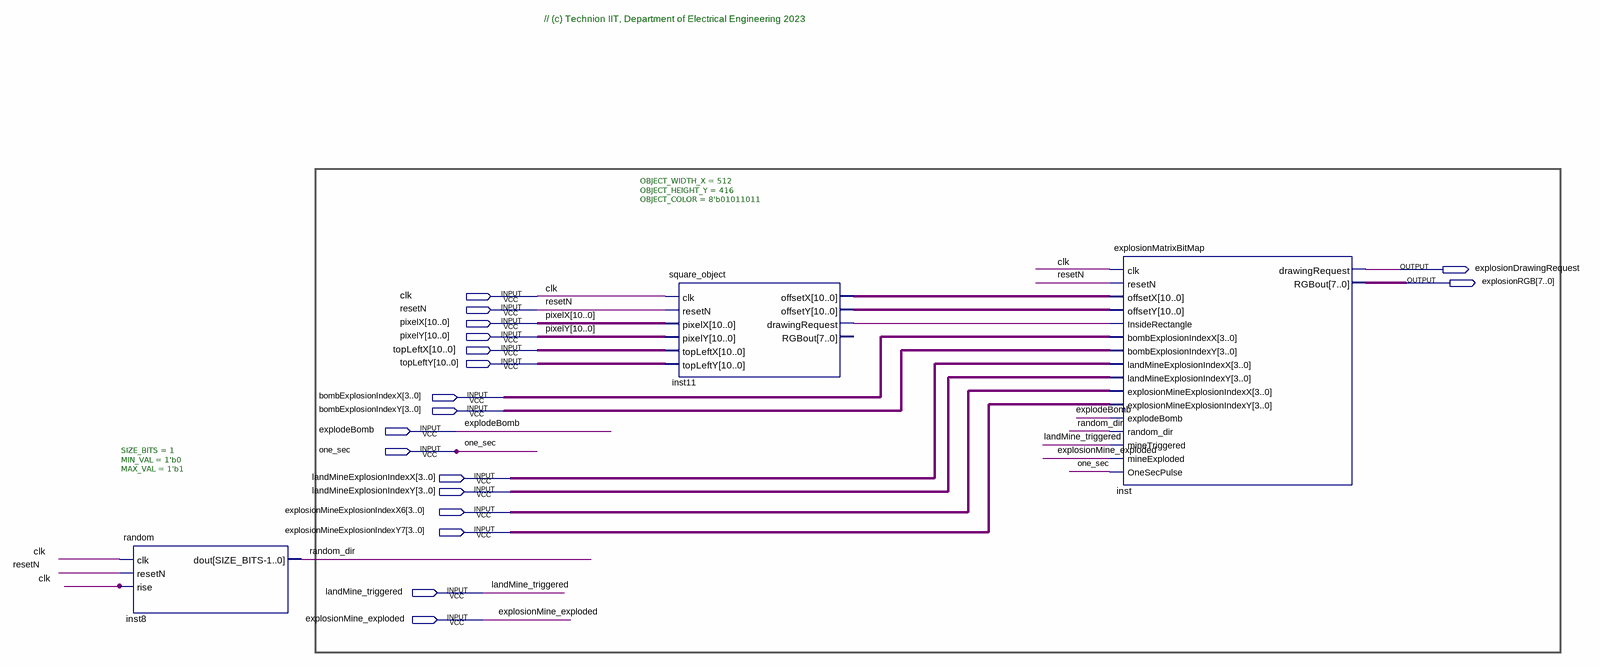
[diagram p0: schematic sheet]
// Quartus schematic Explosion_DISPLAY.bdf as structural Verilog: 3 symbols, 18 pins
module Explosion_DISPLAY (
  input  clk,
  input  resetN,
  input  [10:0] pixelX,
  input  [10:0] pixelY,
  input  [10:0] topLeftX,
  input  [10:0] topLeftY,
  input  [3:0] bombExplosionIndexX,
  input  [3:0] bombExplosionIndexY,
  input  explodeBomb,
  input  one_sec,
  input  [3:0] landMineExplosionIndexX,
  input  [3:0] landMineExplosionIndexY,
  input  [3:0] explosionMineExplosionIndexX6,
  input  [3:0] explosionMineExplosionIndexY7,
  input  landMine_triggered,
  input  explosionMine_exploded,
  output explosionDrawingRequest,
  output [7:0] explosionRGB
);

  wire inst11_drawingrequest, random_dir;
  wire [10:0] inst11_offsetx, inst11_offsety;

  random #(.SIZE_BITS(1), .MIN_VAL(1'b0), .MAX_VAL(1'b1)) inst8 (
    .clk(clk), .resetN(resetN), .rise(clk), .dout(random_dir));
  square_object #(.OBJECT_WIDTH_X(512), .OBJECT_HEIGHT_Y(416), .OBJECT_COLOR(8'b01011011)) inst11 (
    .clk(clk), .resetN(resetN), .pixelX(pixelX), .pixelY(pixelY), .topLeftX(topLeftX), .topLeftY(topLeftY),
    .offsetX(inst11_offsetx), .offsetY(inst11_offsety), .drawingRequest(inst11_drawingrequest));  // open: RGBout
  explosionMatrixBitMap inst (
    .clk(clk), .resetN(resetN), .offsetX(inst11_offsetx), .offsetY(inst11_offsety),
    .InsideRectangle(inst11_drawingrequest), .bombExplosionIndexX(bombExplosionIndexX),
    .bombExplosionIndexY(bombExplosionIndexY), .landMineExplosionIndexX(landMineExplosionIndexX),
    .landMineExplosionIndexY(landMineExplosionIndexY),
    .explosionMineExplosionIndexX(explosionMineExplosionIndexX6),
    .explosionMineExplosionIndexY(explosionMineExplosionIndexY7), .explodeBomb(explodeBomb),
    .random_dir(random_dir), .mineTriggered(landMine_triggered), .mineExploded(explosionMine_exploded),
    .OneSecPulse(one_sec), .drawingRequest(explosionDrawingRequest), .RGBout(explosionRGB));

  // Notes on the sheet:
  //   // (c) Technion IIT, Department of Electrical Engineering 2023
endmodule
